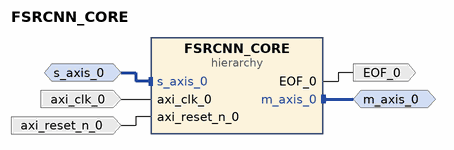
[diagram p0: block diagram of the top level]
# Vivado block design FSRCNN_CORE, xczu9eg-ffvb1156-2-e, Vivado 2022.1
create_bd_design FSRCNN_CORE

create_bd_intf_port -mode Slave -vlnv xilinx.com:interface:axis_rtl:1.0 s_axis_0
set_property -dict [list \
  CONFIG.HAS_TKEEP 0 \
  CONFIG.HAS_TLAST 0 \
  CONFIG.HAS_TREADY 1 \
  CONFIG.HAS_TSTRB 0 \
  CONFIG.LAYERED_METADATA undef \
  CONFIG.TDATA_NUM_BYTES 4 \
  CONFIG.TDEST_WIDTH 0 \
  CONFIG.TID_WIDTH 0 \
  CONFIG.TUSER_WIDTH 0 \
] [get_bd_intf_ports s_axis_0]
create_bd_intf_port -mode Master -vlnv xilinx.com:interface:axis_rtl:1.0 m_axis_0
create_bd_port -dir I -type clk axi_clk_0
create_bd_port -dir I axi_reset_n_0
create_bd_port -dir O EOF_0

create_bd_cell -type hier FSRCNN_CORE

# ---- hierarchy /FSRCNN_CORE ----
current_bd_instance /FSRCNN_CORE
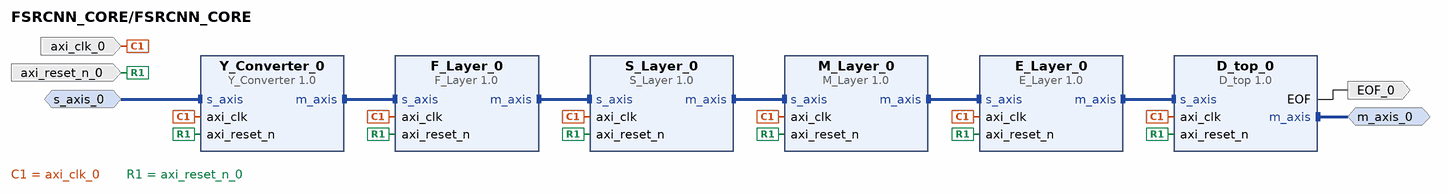
[diagram p1: block diagram inside /FSRCNN_CORE]
create_bd_intf_pin -mode Slave -vlnv xilinx.com:interface:axis_rtl:1.0 s_axis_0
create_bd_intf_pin -mode Master -vlnv xilinx.com:interface:axis_rtl:1.0 m_axis_0
create_bd_pin -dir I -type clk axi_clk_0
create_bd_pin -dir I axi_reset_n_0
create_bd_pin -dir O EOF_0

create_bd_cell -type ip -vlnv xilinx.com:user:F_Layer:1.0 F_Layer_0
create_bd_cell -type ip -vlnv xilinx.com:user:S_Layer:1.0 S_Layer_0
create_bd_cell -type ip -vlnv xilinx.com:user:E_Layer:1.0 E_Layer_0
create_bd_cell -type ip -vlnv xilinx.com:user:Y_Converter:1.0 Y_Converter_0
create_bd_cell -type ip -vlnv xilinx.com:user:M_Layer:1.0 M_Layer_0
create_bd_cell -type ip -vlnv xilinx.com:user:D_top:1.0 D_top_0

# ---- connections ----

current_bd_instance /FSRCNN_CORE
connect_bd_intf_net [get_bd_intf_pins m_axis_0] [get_bd_intf_pins D_top_0/m_axis]
connect_bd_intf_net [get_bd_intf_pins E_Layer_0/m_axis] [get_bd_intf_pins D_top_0/s_axis]
connect_bd_intf_net [get_bd_intf_pins F_Layer_0/m_axis] [get_bd_intf_pins S_Layer_0/s_axis]
connect_bd_intf_net [get_bd_intf_pins M_Layer_0/m_axis] [get_bd_intf_pins E_Layer_0/s_axis]
connect_bd_intf_net [get_bd_intf_pins S_Layer_0/m_axis] [get_bd_intf_pins M_Layer_0/s_axis]
connect_bd_intf_net [get_bd_intf_pins Y_Converter_0/m_axis] [get_bd_intf_pins F_Layer_0/s_axis]
connect_bd_intf_net -intf_net s_axis_0_1 [get_bd_intf_pins s_axis_0] [get_bd_intf_pins Y_Converter_0/s_axis]
connect_bd_net [get_bd_pins D_top_0/EOF] [get_bd_pins EOF_0]
connect_bd_net -net axi_clk_0_1 [get_bd_pins axi_clk_0] \
  [get_bd_pins Y_Converter_0/axi_clk] [get_bd_pins S_Layer_0/axi_clk] [get_bd_pins M_Layer_0/axi_clk] \
  [get_bd_pins E_Layer_0/axi_clk] [get_bd_pins D_top_0/axi_clk] [get_bd_pins F_Layer_0/axi_clk]
connect_bd_net -net axi_reset_n_0_1 [get_bd_pins axi_reset_n_0] \
  [get_bd_pins Y_Converter_0/axi_reset_n] [get_bd_pins S_Layer_0/axi_reset_n] [get_bd_pins M_Layer_0/axi_reset_n] \
  [get_bd_pins E_Layer_0/axi_reset_n] [get_bd_pins D_top_0/axi_reset_n] [get_bd_pins F_Layer_0/axi_reset_n]

current_bd_instance /
connect_bd_intf_net -intf_net D_top_0_m_axis [get_bd_intf_ports m_axis_0] [get_bd_intf_pins FSRCNN_CORE/m_axis_0]
connect_bd_intf_net -intf_net s_axis_0_1 [get_bd_intf_ports s_axis_0] [get_bd_intf_pins FSRCNN_CORE/s_axis_0]
connect_bd_net -net D_top_0_EOF [get_bd_pins FSRCNN_CORE/EOF_0] [get_bd_ports EOF_0]
connect_bd_net -net axi_clk_0_1 [get_bd_ports axi_clk_0] [get_bd_pins FSRCNN_CORE/axi_clk_0]
connect_bd_net -net axi_reset_n_0_1 [get_bd_ports axi_reset_n_0] [get_bd_pins FSRCNN_CORE/axi_reset_n_0]

validate_bd_design
save_bd_design
